# Altium project DisplayReceiver.PrjPcb
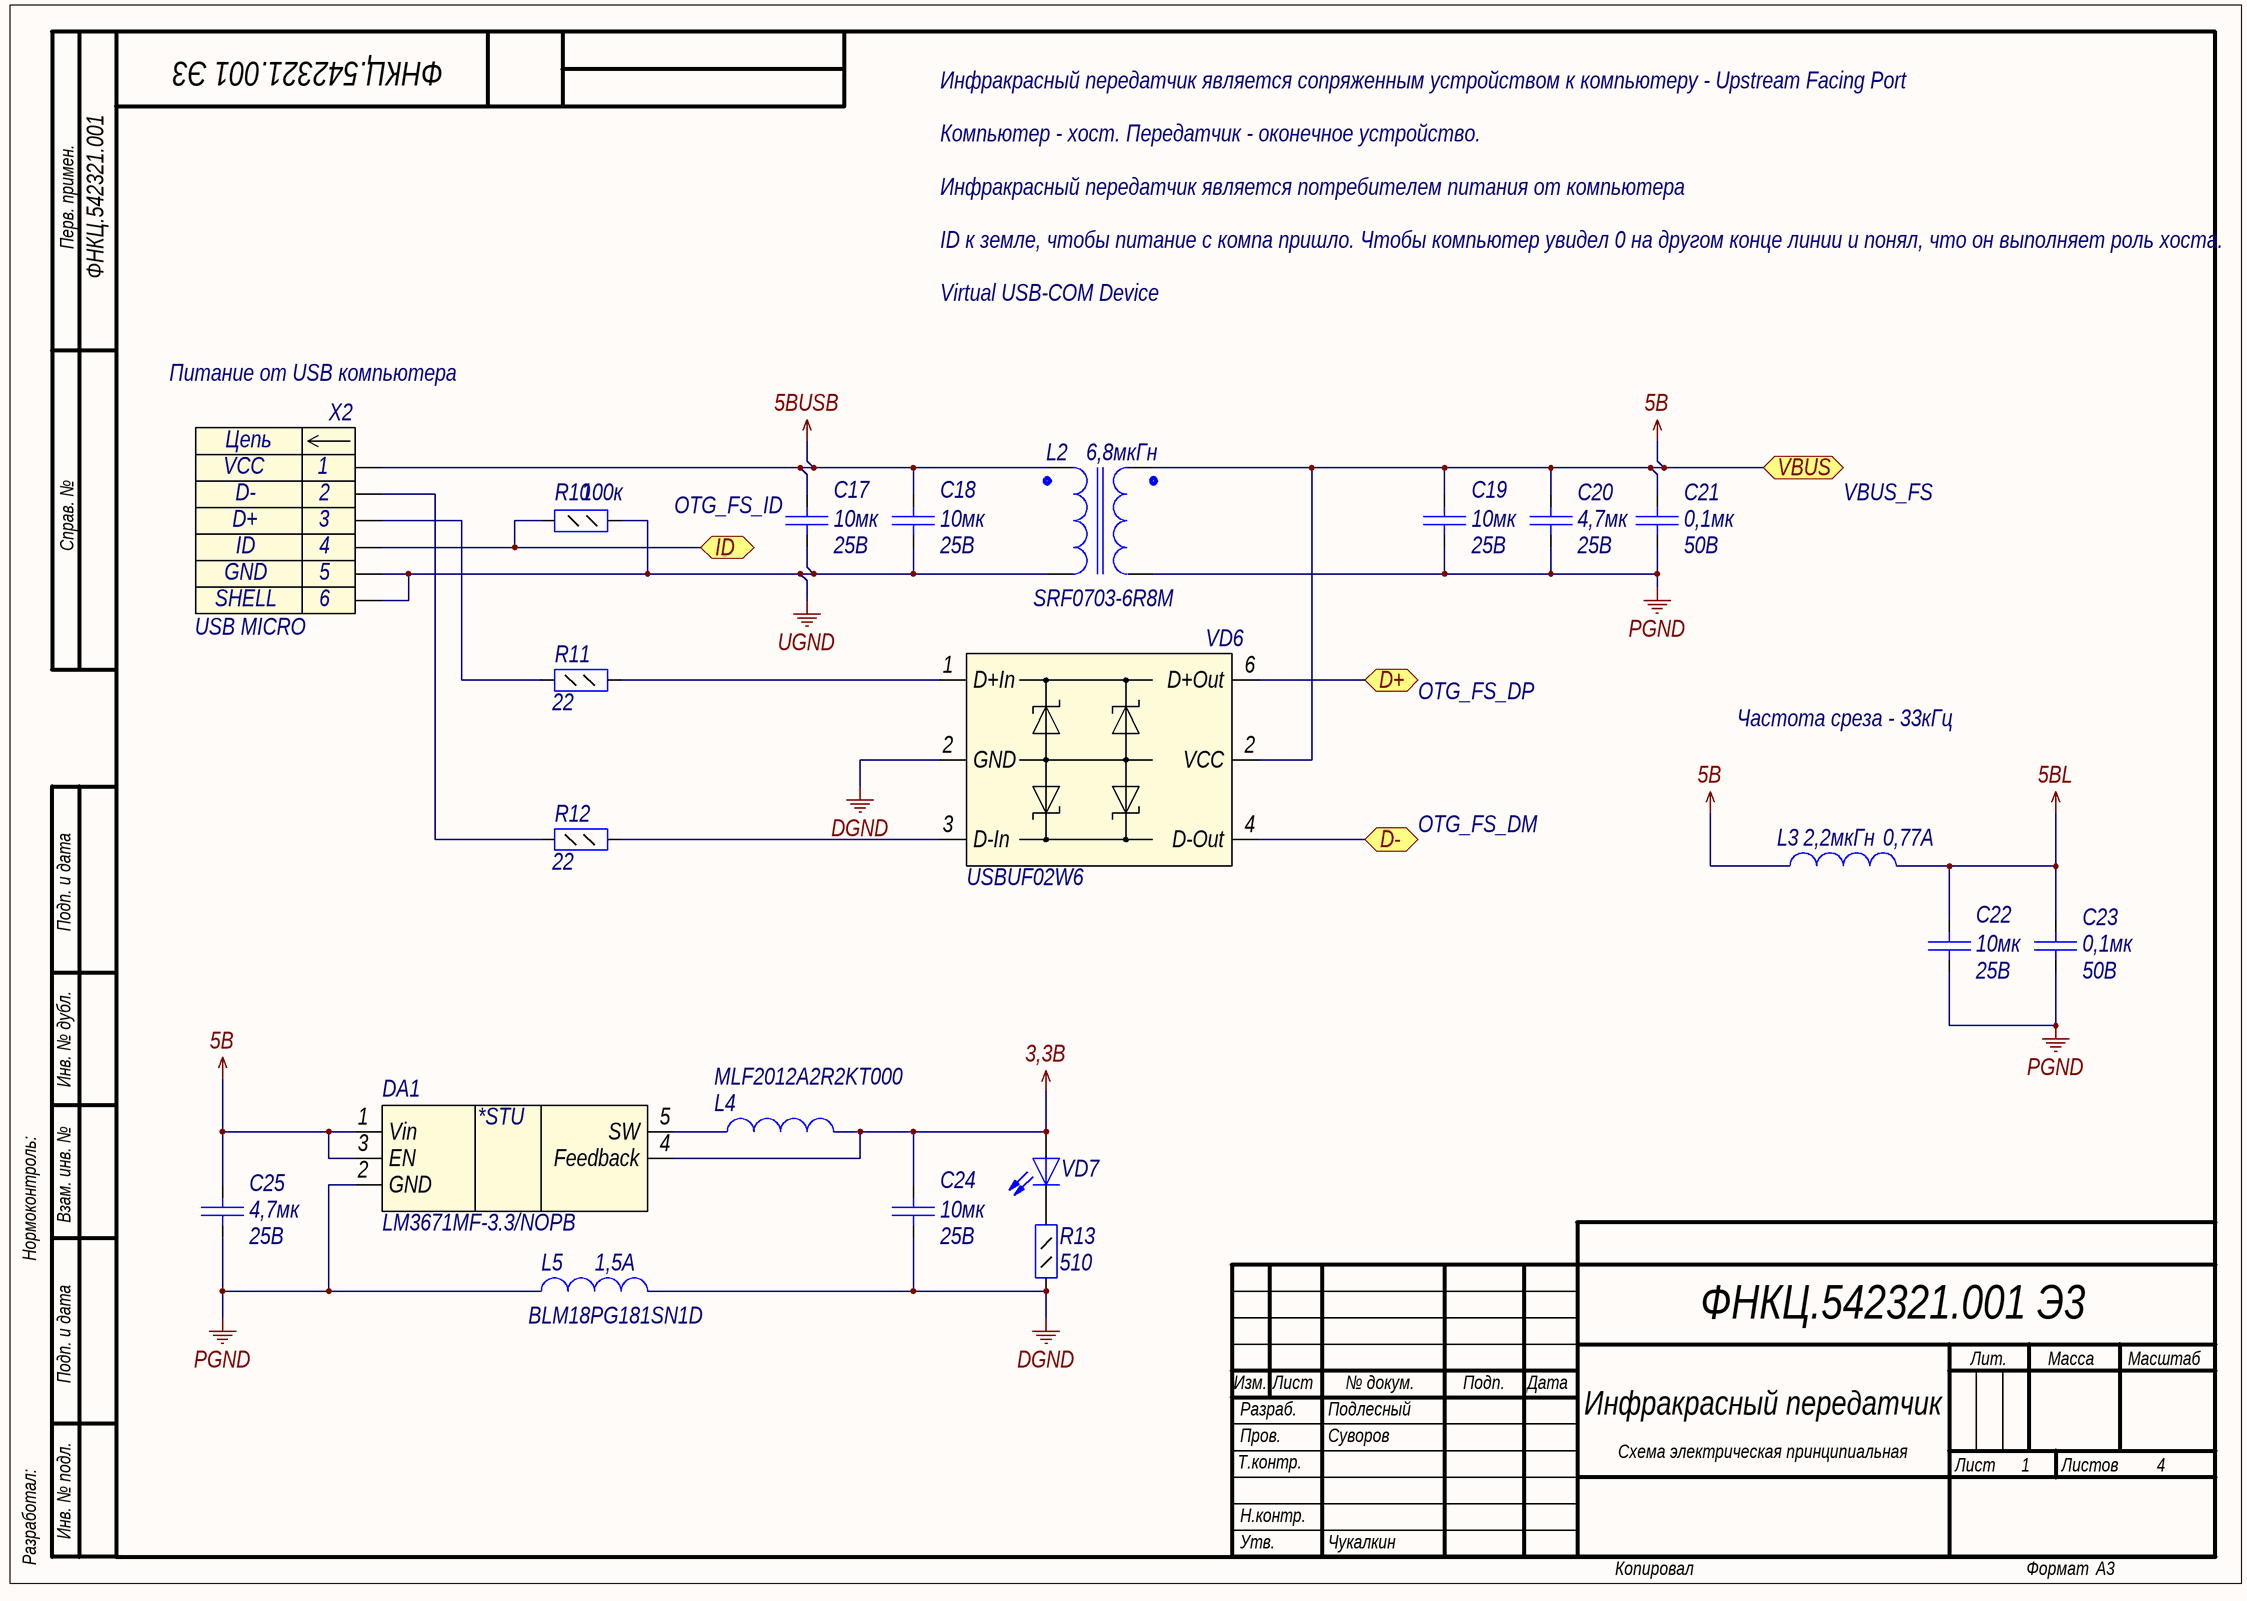
[diagram p0: DisplayReceiver_Perpiph.SchDoc]
2 sheets, 34 parts. Net scope: flat (ports and power ports of the same name join across sheets).
Board file: DisplayReceiver.PcbDoc
Sheets:
  DisplayReceiver_Perpiph.SchDoc
  DisplayReceiver_Microcontroller.SchDoc

## Sheet DisplayReceiver_Perpiph.SchDoc: Инфракрасный передатчик
size 420 x 297 mm; ApprovedBy: Чукалкин; CheckedBy: Суворов; DrawnBy: Подлесный; DocumentNumber: ФНКЦ.542321.001 Э3; SheetNumber: 1; SheetTotal: 4; DocumentType: Схема электрическая принципиальная; Format: A3; ImagePath: ФНКЦ.542321.001

### Parts
C17  value 10мк  Voltage: 25В  [C1206]  (hidden comment: Capacitor)
C18  value 10мк  Voltage: 25В  [C1206]  (hidden comment: Capacitor)
C19  value 10мк  Voltage: 25В  [C1206]  (hidden comment: Capacitor)
C20  value 4,7мк  Voltage: 25B  [C0805]  (hidden comment: Capacitor)
C21  value 0,1мк  Voltage: 50B  [C0805]  (hidden comment: Capacitor)
C22  value 10мк  Voltage: 25В  [C1206]  (hidden comment: Capacitor)
C23  value 0,1мк  Voltage: 50B  [C0805]  (hidden comment: Capacitor)
C24  value 10мк  Voltage: 25В  [C1206]  (hidden comment: Capacitor)
C25  value 4,7мк  Voltage: 25B  [C0805]  (hidden comment: Capacitor)
DA1  LM3671MF-3.3/NOPB  [SOT23-5]
L2  value 6,8мкГн  Part Number: SRF0703-6R8M  [SRF0703]  (hidden comment: Dual-Winding Inductor)
L3  value 2,2мкГн  Rated Current: 0,77A  [L1210]  (hidden comment: Inductor)
L4  Part Number: MLF2012A2R2KT000  [L0805]  (hidden comment: Inductor)
L5  Rated Current: 1,5A  Part Number: BLM18PG181SN1D  [L0603]  (hidden comment: Inductor)
R10  value 100к  [R0805]  (hidden comment: Resistor_0,125Вт)
R11  value 22  [R0805]  (hidden comment: Resistor_0,125Вт)
R12  value 22  [R0805]  (hidden comment: Resistor_0,125Вт)
R13  value 510  [R0805]  (hidden comment: Resistor_0,125Вт)
VD6  Part Number: USBUF02W6  [SOT323-6L]  (hidden comment: USBUF)
VD7  LED  [L_0805]  (value not drawn)
X2  USB MICRO  [USB-B Micro]

### Ports
D+, D-, ID, VBUS

### Nets
3,3В: C24.2 DA1.4(Feedback) L4.2 VD7.2(A)
5В: C19.2 C20.2 C21.2 C25.2 DA1.1(Vin) DA1.3(EN) L2.2 L3.1 VD6.2(VCC) ; port VBUS
5ВL: C22.2 C23.2 L3.2
5ВUSB: C17.2 C18.2 L2.1 X2.1
DGND: C24.1 L5.2 R13.1 VD6.2(GND)
PGND: C19.1 C20.1 C21.1 C22.1 C23.1 C25.1 DA1.2(GND) L2.4 L5.1
UGND: C17.1 C18.1 L2.3 R10.1 X2.5 X2.6
NetDA1_5: DA1.5(SW) L4.1
NetR10_2: R10.2 X2.4 ; port ID
NetR11_1: R11.1 X2.3
NetR11_2: R11.2 VD6.1(D+In)
NetR12_1: R12.1 X2.2
NetR12_2: R12.2 VD6.3(D-In)
NetR13_2: R13.2 VD7.1(K)
NetVD6_4: VD6.4(D-Out) ; port D-
NetVD6_6: VD6.6(D+Out) ; port D+

### Notes on the sheet
- Инфракрасный передатчик является сопряженным устройством к компьютеру - Upstream Facing Port
- Перв. примен.
- Компьютер - хост. Передатчик - оконечное устройство.
- Инфракрасный передатчик является потребителем питания от компьютера
- ID к земле, чтобы питание с компа пришло. Чтобы компьютер увидел 0 на другом конце линии и понял, что он выполняет роль хоста.
- Virtual USB-COM Device
- Питание от USB компьютера
- Справ. №
- (near C17) OTG_FS_ID
- VBUS_FS
- OTG_FS_DP
- Частота среза - 33кГц
- OTG_FS_DM
- Подп. и дата
- Инв. № дубл.
- Нормоконтроль:
- Взам. инв. №
- Изм.
- Лист
- № докум.
- Подп.
- Дата
- Лит.
- Масса
- Масштаб
- Т.контр.
- Пров.
- Разраб.
- Листов
- Разработал:
- Инв. № подл.
- Н.контр.
- Утв.
- Копировал
- Формат
- (in symbol connect2) Цепь; SHELL
- (in symbol pwr2) *STU

### Library data of the parts
C17-C19 C22 C24 = cap187: Конденсатор; Part Name: Ceramic; Manufacture: Murata; Part Number: GRM31CR71E106KA12L*; id: cap187; TKE: X7R
C20 C25 = cap154: Конденсатор; Part Name: Ceramic; Manufacture: Murata; Part Number: GRM21BR61E475KA12L; id: cap154; TKE: X5R
C21 C23 = cap142: Конденсатор; Part Name: Ceramic; Manufacture: Murata; Part Number: GRM21BR71H104K**; id: cap142; TKE: X7R
DA1 = pwr2: Step-Down DC-DC Converter; Part Name: 600-mA Step-Down DC-DC Converter; Manufacturer: Texas Instruments; id: pwr2; Input Voltage: 2,7 - 5,5B; Output Voltage: 3,3B; Current: 0,6A; Type: Impulse; Part Number: LM3671MF-3.3/NOPB
L2 = ind15: Синфазный дроссель; Part Name: Dual-Winding Shielded Power Inductors; Manufacture: Bourns; Rated Current: 2,55A; id: ind15; Saturation Current: 3,12A; Resistance: 0.0658Ohm
L3 = ind1: EMI Suppression Filter; Part Number: NLCV32T-2R2M-EF; id: ind1; Resistance: 0,13Ohm; q-factor: 10; Part Name: Inductor
L4 = ind4: EMI Suppression Filter; Manufacture: Mouser; id: ind4; Resistance: 500mOhm; Part Name: Inductor
L5 = ind0: EMI Suppression Filter; Part Name: EMI Suppression Filters; id: ind0; Resistance: 0,09Ohm
R10 = res121: Резистор; Manufacture: Yageo; Part Number: RC0805FR-07100KL; id: res121; Accuracy: 1%; Part Name: Resistor; Power: 0,125Вт
R11 R12 = res33: Резистор; Manufacture: Yageo; Part Number: RC0805FR-0722RL; id: res33; Accuracy: 1%; Part Name: Resistor; Power: 0,125Вт
R13 = res66: Резистор; Manufacture: Yageo; Part Number: RC0805FR-07510RL; id: res66; Accuracy: 1%; Part Name: Resistor; Power: 0,125Вт
VD6 = diode23: EMEMI filter and line termination for USB upstream ports; Part Name: EMI filter for USB upstream ports; Manufacture: ST Microelectronics; Capacitance: 47pF; Number of Channels: 2; id: diode23
VD7 = diode8: Светодиод; Part Number: KP-2012EC; id: diode8; Part Name: LED
X2 = connect2: Part Name: Micro USB 5S-B; Part Number: KLS1-233-0-0-1-T; Contact_1: VCC; Contact_2: D-; Contact_3: D+; Contact_4: ID; Contact_5: GND; Contact_6: Shell; id: connect2

## Sheet DisplayReceiver_Microcontroller.SchDoc
size 420 x 297 mm; DocumentNumber: ФНКЦ.542321.001 Э3; SheetNumber: 3; Format: A3
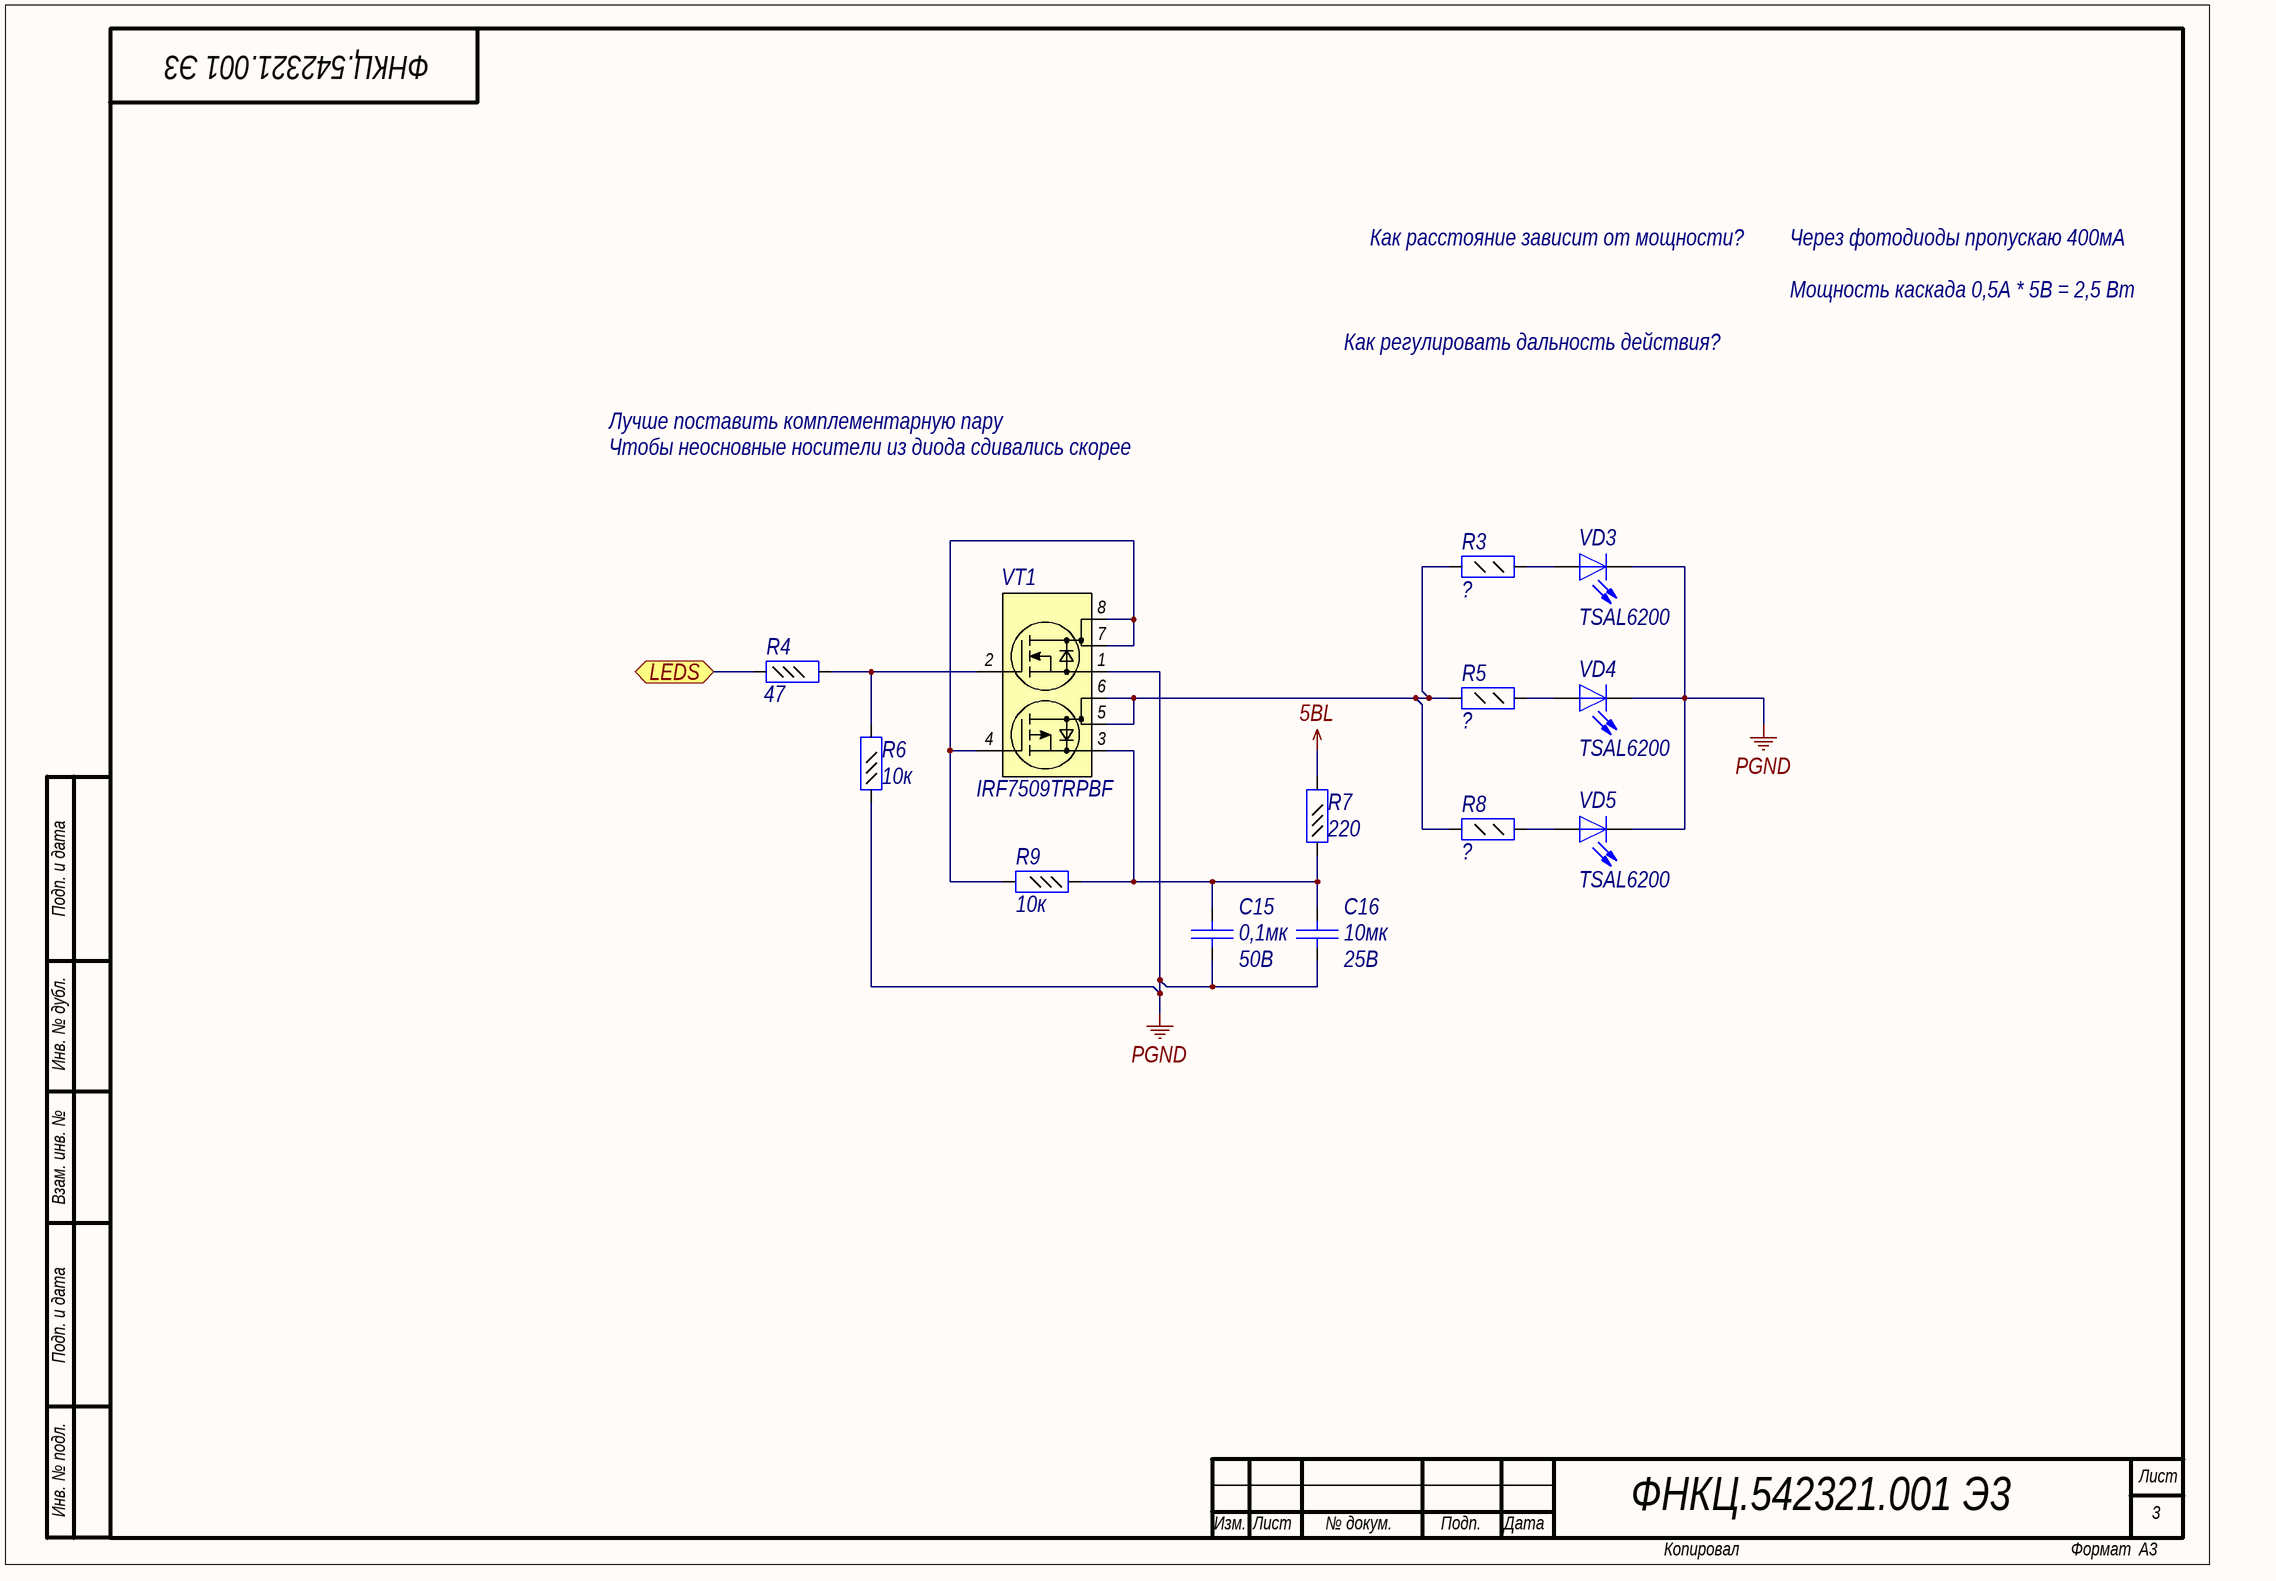
[diagram p1: DisplayReceiver_Microcontroller.SchDoc]

### Parts
C15  value 0,1мк  Voltage: 50B  [C0603]  (hidden comment: Capacitor)
C16  value 10мк  Voltage: 25В  [C1210]  (hidden comment: Capacitor)
R3  Resistor_0,125Вт  [R0805]  (value not drawn)
R4  value 47  [R0603]  (hidden comment: Resistor_0,062Вт)
R5  Resistor_0,125Вт  [R0805]  (value not drawn)
R6  value 10к  [R0603]  (hidden comment: Resistor_0,062Вт)
R7  value 220  [R0603]  (hidden comment: Resistor_0,062Вт)
R8  Resistor_0,125Вт  [R0805]  (value not drawn)
R9  value 10к  [R0603]  (hidden comment: Resistor_0,062Вт)
VD3  Part Number: TSAL6200  [RADIAL_5MM]  (hidden comment: LED)
VD4  Part Number: TSAL6200  [RADIAL_5MM]  (hidden comment: LED)
VD5  Part Number: TSAL6200  [RADIAL_5MM]  (hidden comment: LED)
VT1  IRF7509TRPBF  [Micro8]

### Ports
LEDS

### Nets
5ВL: R7.2
PGND: C15.1 C16.1 R6.1 VD3.1(K) VD4.1(K) VD5.1(K) VT1.1(S1)
NetC15_2: C15.2 C16.2 R7.1 R9.1 VT1.3(S2)
NetR3_1: R3.1 VD3.2(A)
NetR3_2: R3.2 R5.2 R8.2 VT1.5(D2) VT1.6(D2)
NetR4_1: R4.1 ; port LEDS
NetR4_2: R4.2 R6.2 VT1.2(G1)
NetR5_1: R5.1 VD4.2(A)
NetR8_1: R8.1 VD5.2(A)
NetR9_2: R9.2 VT1.4(G2) VT1.7(D1) VT1.8(D1)

### Notes on the sheet
- Как расстояние зависит от мощности?
- Через фотодиоды пропускаю 400мА
- Мощность каскада 0,5А * 5В = 2,5 Вт
- Как регулировать дальность действия?
- Лучше поставить комплементарную пару
- Чтобы неосновные носители из диода сдивались скорее
- Подп. и дата
- Инв. № дубл.
- Взам. инв. №
- Инв. № подл.
- Лист
- Изм.
- № докум.
- Подп.
- Дата
- Копировал
- Формат

### Library data of the parts
C15 = cap131: Конденсатор; Part Name: Ceramic; Manufacture: Murata; Part Number: GRM188R71H104K; id: cap131; TKE: X7R
C16 = cap194: Конденсатор; Part Name: Ceramic; Manufacture: Murata; Part Number: GRM32ER61A106K; id: cap194; TKE: X7R
R3 R5 R8 = res33: as R11 on sheet DisplayReceiver_Perpiph; Value: ?; Part Name: Resistor; Power: 0,125Вт
R4 = res427: Резистор; Manufacture: Yageo; Part Number: RC0603FR-0747RL; id: res427; Accuracy: 1%; Part Name: Resistor; Power: 0,062Вт
R6 R9 = res483: Резистор; Manufacture: Yageo; Part Number: RC0603FR-0710KL; id: res483; Accuracy: 1%; Part Name: Resistor; Power: 0,062Вт
R7 = res443: Резистор; Manufacture: Yageo; Part Number: RC0603FR-07220RL; id: res443; Accuracy: 1%; Part Name: Resistor; Power: 0,062Вт
VD3-VD5 = diode24: Светодиод; Part Name: High Power Infrared Emitting Diode; Manufacture: Vishay; Max Reverse Voltage: 5B; Forward Voltage: 1,35-2,2B; Forward Current: 100mA; Surge Forward Current: 1,5A(impulse - 100us); Radiant intensity: 72-600mW/sr; Radiant power: 40mW; Max Power dissipation: 160mW; Angle of half intensity: (+-)17; Peak wavelength: 940nm; Number of Channels: 1; id: diode24
VT1 = trans3: Комплементарная сборка МОП; Part Name: Dual Transistor; Manufacturer: International Rectifier; id: trans3; Structure: n-p-channel; V drain-source max: 30B; Rds: 0,11Ohm; Gate-to-source voltage: (+-)20B; Continuous drain current: 2A; Pulsed drain current: 16A; Power dissipation: 1,25W; Part Number: IRF7509TRPBF

## Nets that join several sheets
5ВL: DisplayReceiver_Perpiph (C22.2 C23.2 L3.2), DisplayReceiver_Microcontroller (R7.2)
PGND: DisplayReceiver_Perpiph (9 pins), DisplayReceiver_Microcontroller (7 pins)